# EAGLE schematic UAV_ARM (EAGLE 7.0.0)
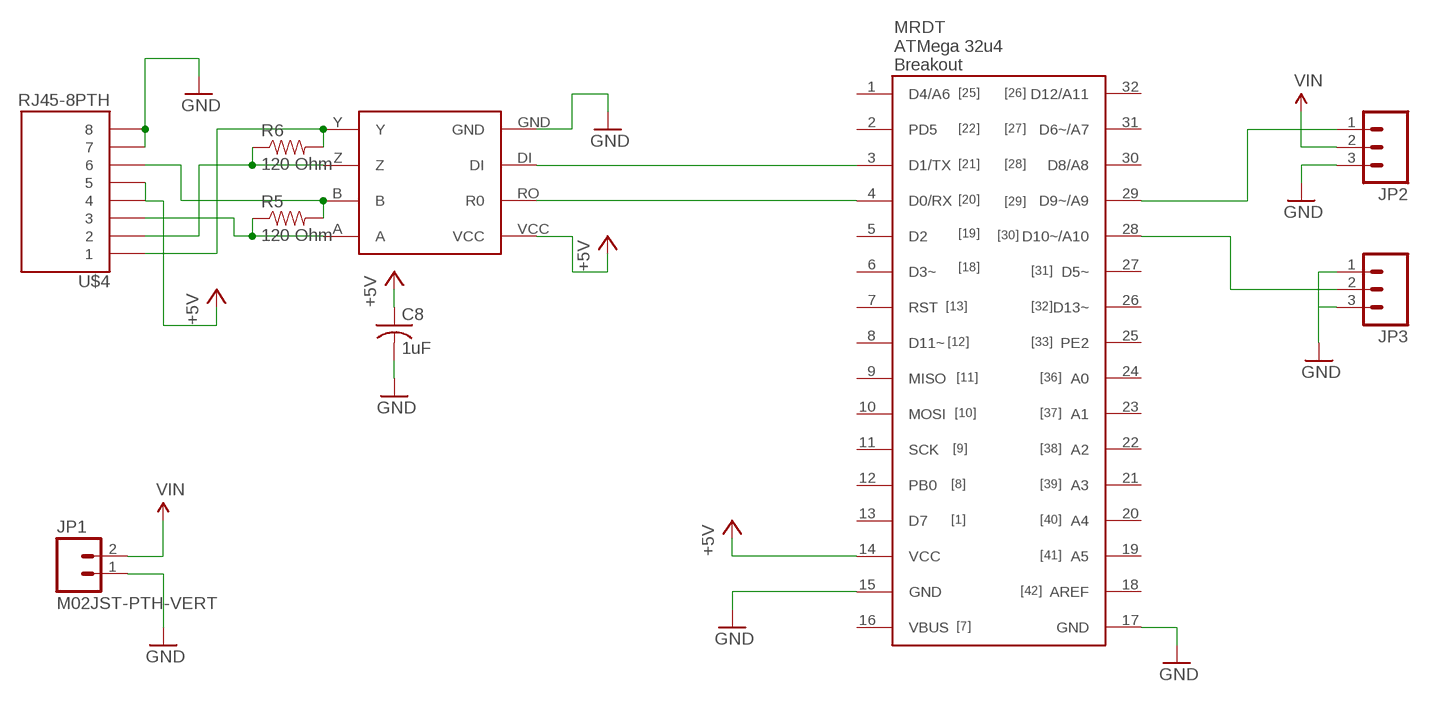
[diagram p0: schematic, sheet 1]

## Parts
C8  1uF  C-USC1206  [C1206]
JP1  M02JST-PTH-VERT  [JST-2-PTH-VERT]
JP2  M03JST-PTH  [JST-3-PTH]
JP3  M03JST-PTH  [JST-3-PTH]
R5  120 Ohm  RESISTOR1206  [1206]
R6  120 Ohm  RESISTOR1206  [1206]
U$2  32U4_BREAKOUT  [32U4_MCU_DIP]
U$3  MAX3077  [MAX3070E]
U$4  RJ45-8PTH  [RJ45-8]

## Nets
+5V: C8.1 U$2.14(VCC) U$3.VCC U$4.4 U$4.5
GND: C8.2 JP1.1 JP2.3 JP3.1 JP3.3 U$2.15(GND) U$2.17(GND) U$3.GND U$4.7 U$4.8
N$1: JP3.2 U$2.28(D10~/A10)
N$2: JP2.1 U$2.29(D9~/A9)
N$12: R6.2 U$3.Y U$4.1
N$18: R6.1 U$3.Z U$4.2
N$19: R5.2 U$3.B U$4.6
N$20: R5.1 U$3.A U$4.3
N$21: U$2.3(D1/TX) U$3.DI
RXD: U$2.4(D0/RX) U$3.RO(R0)
VIN: JP1.2 JP2.2
Unconnected: U$2.1(D4/A6) U$2.2(PD5) U$2.5(D2) U$2.6(D3~) U$2.7(RST) U$2.8(D11~) U$2.9(MISO) U$2.10(MOSI) U$2.11(SCK) U$2.12(PB0) U$2.13(D7) U$2.16(VBUS) U$2.18(AREF) U$2.19(A5) U$2.20(A4) U$2.21(A3) U$2.22(A2) U$2.23(A1) U$2.24(A0) U$2.25(PE2) U$2.26(D13~) U$2.27(D5~) U$2.30(D8/A8) U$2.31(D6~/A7) U$2.32(D12/A11)

## Library data of the parts
C8 = resistor:C-US: CAPACITOR, American symbol
JP1 = SparkFun-Connectors:M02: Standard 2-pin 0.1" header. Use with - straight break away headers ( PRT-00116) - right angle break away headers (PRT-00553) - swiss pins (PRT-00743) - machine pins (PRT-00117) - female headers (PRT-00115) Molex polarized connector foot print use with: PRT-08233 with associated crimp pins and housings. 2.54_SCREWTERM for use with PRT-10571. 3.5mm Screw Terminal footprints for PRT-08084 5mm Screw Terminal footprints for use with PRT-08433
JP2 JP3 = SparkFun-Connectors:M03: Header 3 Standard 3-pin 0.1" header. Use with straight break away headers (SKU : PRT-00116), right angle break away headers (PRT-00553), swiss pins (PRT-00743), machine pins (PRT-00117), and female headers (PRT-00115). Molex polarized connector foot print use with SKU : PRT-08232 with associated crimp pins and housings.; SKU: PRT-09915
R5 R6 = SparkFun-Passives:RESISTOR: Resistor Basic schematic elements and footprints for 0603, 1206, and PTH resistors.
U$2 = MRDT-2015-General:32U4_BREAKOUT
U$3 = MAX3077:MAX3077
U$4 = SparkFun-Connectors:RJ45-8: RJ45 Jack Simple RJ45, 8-pin connection - connector for common Cat5, Cat5e, and Cat6 Ethernet cables. Footprint not yet proven in production. Connector sku is PRT-00643; Breakout PCB sku is BOB-00716.